# EAGLE design signal_mux_b (EAGLE 5.09)
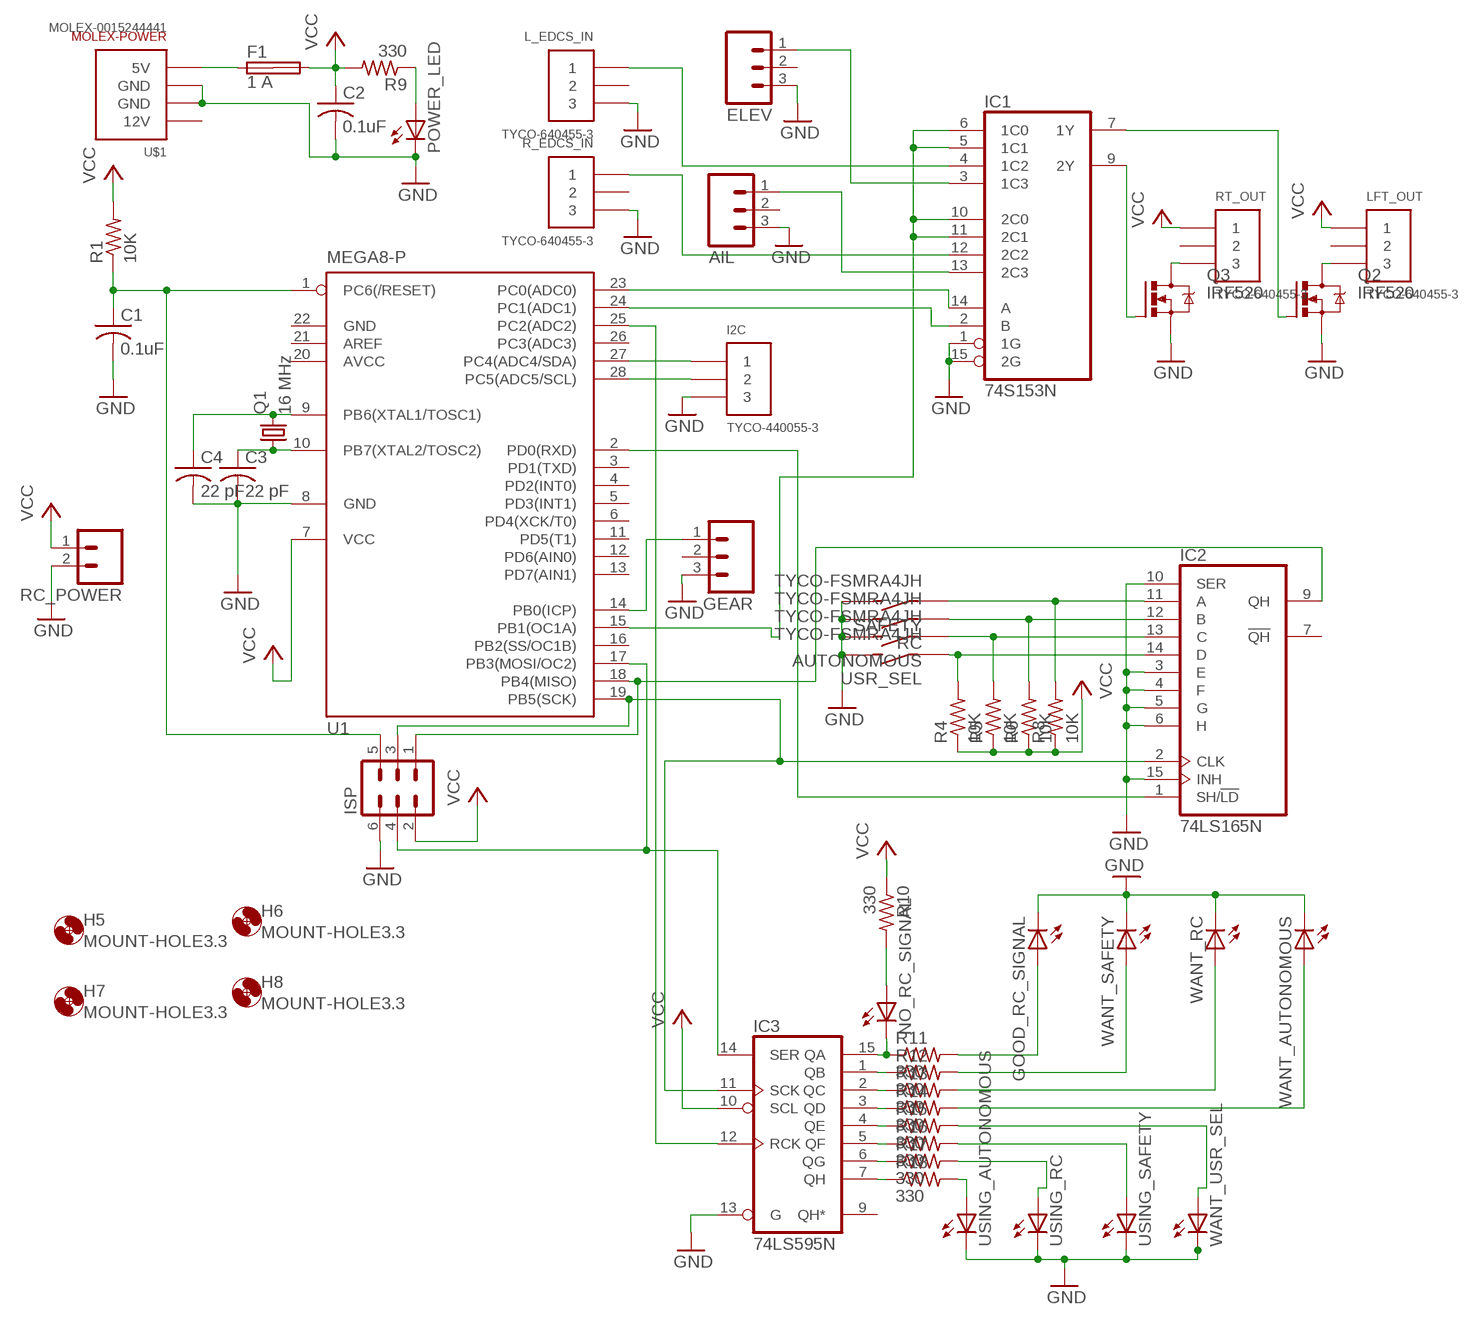
[diagram p0: schematic, sheet 1]

## Parts
AIL  M03POLAR  [MOLEX-1X3]
AUTONOMOUS  TYCO-FSMRA4JH  [TYCO-FSMRA4JH]
C1  0.1uF  C-US050-055X075  [C050-055X075]
C2  0.1uF  C-US050-055X075  [C050-055X075]
C3  22 pF  C-US025-025X050  [C025-025X050]
C4  22 pF  C-US025-025X050  [C025-025X050]
ELEV  M03POLAR  [MOLEX-1X3]
F1  1 A  SHK20Q  [SHK20Q]
GEAR  M03POLAR  [MOLEX-1X3]
GOOD_RC_SIGNAL  LED3MM  [LED3MM]
H5  MOUNT-HOLE3.3  [3,3]
H6  MOUNT-HOLE3.3  [3,3]
H7  MOUNT-HOLE3.3  [3,3]
H8  MOUNT-HOLE3.3  [3,3]
I2C  TYCO-440055-3  [HEADER-RA-2.00MM-3]
IC1  74S153N  [DIL16]
IC2  74LS165N  [DIL16]
IC3  74LS595N  [DIL16]
ISP  MA03-2  [MA03-2]
L_EDCS_IN  TYCO-640455-3  [HEADER-RA-POL-.100IN-3]
LFT_OUT  TYCO-640455-3  [HEADER-RA-POL-.100IN-3]
NO_RC_SIGNAL  LED3MM  [LED3MM]
POWER_LED  LED5MM  [LED5MM]
Q1  16 MHz  CRYSTALHC49S  [HC49/S]
Q2  IRF520  [TO220BV]
Q3  IRF520  [TO220BV]
R1  10K  R-US_0207/10  [0207/10]
R4  10K  R-US_0207/10  [0207/10]
R5  10K  R-US_0207/10  [0207/10]
R6  10K  R-US_0207/10  [0207/10]
R8  10K  R-US_0207/10  [0207/10]
R9  330  R-US_0207/10  [0207/10]
R10  330  R-US_0207/10  [0207/10]
R11  330  R-US_0207/10  [0207/10]
R12  330  R-US_0207/10  [0207/10]
R13  330  R-US_0207/10  [0207/10]
R14  330  R-US_0207/10  [0207/10]
R15  330  R-US_0207/10  [0207/10]
R16  330  R-US_0207/10  [0207/10]
R17  330  R-US_0207/10  [0207/10]
R18  330  R-US_0207/10  [0207/10]
R_EDCS_IN  TYCO-640455-3  [HEADER-RA-POL-.100IN-3]
RC  TYCO-FSMRA4JH  [TYCO-FSMRA4JH]
RC_POWER  M02POLAR  [MOLEX-1X2]
RT_OUT  TYCO-640455-3  [HEADER-RA-POL-.100IN-3]
SAFETY  TYCO-FSMRA4JH  [TYCO-FSMRA4JH]
U1  MEGA8-P  [DIL28-3]
U$1  MOLEX-0015244441  [MOLEX-0015244441B]
USING_AUTONOMOUS  LED3MM  [LED3MM]
USING_RC  LED3MM  [LED3MM]
USING_SAFETY  LED3MM  [LED3MM]
USR_SEL  TYCO-FSMRA4JH  [TYCO-FSMRA4JH]
WANT_AUTONOMOUS  LED3MM  [LED3MM]
WANT_RC  LED3MM  [LED3MM]
WANT_SAFETY  LED3MM  [LED3MM]
WANT_USR_SEL  LED3MM  [LED3MM]

## Nets
GND: AIL.3 AUTONOMOUS.2 C1.2 C2.2 C3.2 C4.2 ELEV.3 GEAR.3 GOOD_RC_SIGNAL.K(C) I2C.3 IC1.1(1G) IC1.15(2G) IC2.3(E) IC2.4(F) IC2.5(G) IC2.6(H) IC2.10(SER) IC2.15(INH) IC3.13(G) ISP.6 L_EDCS_IN.3 POWER_LED.K(C) Q2.S Q3.S R_EDCS_IN.3 RC.2 RC_POWER.2 SAFETY.2 U1.8(GND) U$1.2(GND) U$1.3(GND) USING_AUTONOMOUS.K(C) USING_RC.K(C) USING_SAFETY.K(C) USR_SEL.2 WANT_AUTONOMOUS.K(C) WANT_RC.K(C) WANT_SAFETY.K(C) WANT_USR_SEL.K(C)
N$1: C1.1 ISP.5 R1.1 U1.1(PC6(/RESET))
N$2: NO_RC_SIGNAL.A R10.2
N$3: IC3.15(QA) NO_RC_SIGNAL.K(C) R11.1
N$4: IC1.14(A) U1.23(PC0(ADC0))
N$5: GEAR.1 U1.14(PB0(ICP))
N$6: IC1.9(2Y) Q3.G
N$7: Q3.D RT_OUT.3
N$8: IC1.5(1C1) IC1.6(1C0) IC1.10(2C0) IC1.11(2C1) U1.15(PB1(OC1A))
N$9: IC2.1(SH/!LD) U1.2(PD0(RXD))
N$10: IC1.2(B) U1.24(PC1(ADC1))
N$11: IC1.4(1C2) L_EDCS_IN.1
N$12: IC1.12(2C2) R_EDCS_IN.1
N$13: AIL.1 IC1.13(2C3)
N$14: ELEV.1 IC1.3(1C3)
N$16: R18.2 USING_AUTONOMOUS.A
N$17: IC3.12(RCK) U1.25(PC2(ADC2))
N$18: LFT_OUT.3 Q2.D
N$20: R17.2 USING_RC.A
N$21: R16.2 USING_SAFETY.A
N$22: R15.2 WANT_USR_SEL.A
N$24: C3.1 Q1.1 U1.10(PB7(XTAL2/TOSC2))
N$25: IC2.14(D) R4.2 USR_SEL.1
N$26: AUTONOMOUS.1 IC2.13(C) R5.2
N$28: POWER_LED.A R9.1
N$30: IC2.11(A) R8.2 SAFETY.1
N$31: C4.1 Q1.2 U1.9(PB6(XTAL1/TOSC1))
N$32: IC2.12(B) R6.2 RC.1
N$35: IC1.7(1Y) Q2.G
N$36: IC3.1(QB) R12.1
N$37: IC3.2(QC) R13.1
N$38: IC3.3(QD) R14.1
N$39: IC3.4(QE) R15.1
N$40: IC3.5(QF) R16.1
N$41: IC3.6(QG) R17.1
N$42: IC3.7(QH) R18.1
N$44: F1.1A U$1.4(5V)
N$48: R14.2 WANT_AUTONOMOUS.A
N$49: R13.2 WANT_RC.A
N$50: R12.2 WANT_SAFETY.A
N$51: GOOD_RC_SIGNAL.A R11.2
N$55: I2C.1 U1.27(PC4(ADC4/SDA))
N$56: I2C.2 U1.28(PC5(ADC5/SCL))
N$65: IC2.9(QH) ISP.1 U1.18(PB4(MISO))
N$66: IC2.2(CLK) IC3.11(SCK) ISP.3 U1.19(PB5(SCK))
N$67: IC3.14(SER) ISP.4 U1.17(PB3(MOSI/OC2))
VCC: C2.1 F1.2A IC3.10(SCL) ISP.2 LFT_OUT.1 R1.2 R4.1 R5.1 R6.1 R8.1 R9.2 R10.1 RC_POWER.1 RT_OUT.1 U1.7(VCC)
Unconnected: AIL.2 ELEV.2 F1.1B F1.2B GEAR.2 IC2.7(!QH) IC3.9(QH*) L_EDCS_IN.2 LFT_OUT.2 R_EDCS_IN.2 RT_OUT.2 U1.3(PD1(TXD)) U1.4(PD2(INT0)) U1.5(PD3(INT1)) U1.6(PD4(XCK/T0)) U1.11(PD5(T1)) U1.12(PD6(AIN0)) U1.13(PD7(AIN1)) U1.16(PB2(SS/OC1B)) U1.21(AREF) U1.26(PC3(ADC3))

## Power pins joined to a net without a drawn wire
12V: U$1.1(12V)
AVCC: U1.20(AVCC)
GND: IC1.8(GND) IC2.8(GND) IC3.8(GND) U1.22(GND)
VCC: IC1.16(VCC) IC2.16(VCC) IC3.16(VCC)

## Library data of the parts
AIL ELEV GEAR = SparkFun:M03: Header 3 Standard 3-pin 0.1" header. Use with straight break away headers (SKU : PRT-00116), right angle break away headers (PRT-00553), swiss pins (PRT-00743), machine pins (PRT-00117), and female headers (PRT-00115). Molex polarized connector foot print use with SKU : PRT-08232 with associated crimp pins and housings.
AUTONOMOUS RC SAFETY USR_SEL = chicagoedt:TYCO-FSMRA4JH: Tyco Electronics FSMRA4JH tactile switch.
C1-C4 = resistor:C-US: CAPACITOR, American symbol
F1 = fuse:SHK20Q: FUSE HOLDER 5 x 20 mm, SH contact, E1207 Buerklin 64G6061
GOOD_RC_SIGNAL NO_RC_SIGNAL POWER_LED USING_AUTONOMOUS USING_RC USING_SAFETY WANT_AUTONOMOUS WANT_RC WANT_SAFETY WANT_USR_SEL = led:LED: LED OSRAM: - CHIPLED LG R971, LG N971, LY N971, LG Q971, LY Q971, LO R971, LY R971 LH N974, LH R974 LS Q976, LO Q976, LY Q976 LO Q996 - Hyper CHIPLED LW Q18S LB Q993, LB Q99A, LB R99A - SideLED LS A670, LO A670, LY A670, LG A670, LP A670 LB A673, LV A673, LT A673, LW A673 LH A674 LY A675 LS A676, LA A676, LO A676, LY A676, LW A676 LS A679, LY A679, LG A679 - Hyper Micro SIDELED® LS Y876, LA Y876, LO Y876, LY Y876 LT Y87S - SmartLED LW L88C, LW L88S LB L89C, LB L89S, LG L890 LS L89K, LO L89K, LY L89K LS L896, LA L896, LO L896, LY L896 - TOPLED LS T670, LO T670, LY T670, LG T670, LP T670 LSG T670, LSP T670, LSY T670, LOP T670, LYG T670 LG T671, LOG T671, LSG T671 LB T673, LV T673, LT T673, LW T673 LH T674 LS T676, LA T676, LO T676, LY T676, LB T676, LH T676, LSB T676, LW T676 LB T67C, LV T67C, LT T67C, LS T67K, LO T67K, LY T67K, LW E67C LS E67B, LA E67B, LO E67B, LY E67B, LB E67C, LV E67C, LT E67C LW T67C LS T679, LY T679, LG T679 LS T770, LO T770, LY T770, LG T770, LP T770 LB T773, LV T773, LT T773, LW T773 LH T774 LS E675, LA E675, LY E675, LS T675 LS T776, LA T776, LO T776, LY T776, LB T776 LHGB T686 LT T68C, LB T68C - Hyper Mini TOPLED® LB M676 - Mini TOPLED Santana® LG M470 LS M47K, LO M47K, LY M47K Source: http://www.osram.convergy.de LUXEON: - LUMILED® LXK2-PW12-R00, LXK2-PW12-S00, LXK2-PW14-U00, LXK2-PW14-V00 LXK2-PM12-R00, LXK2-PM12-S00, LXK2-PM14-U00 LXK2-PE12-Q00, LXK2-PE12-R00, LXK2-PE12-S00, LXK2-PE14-T00, LXK2-PE14-U00 LXK2-PB12-K00, LXK2-PB12-L00, LXK2-PB12-M00, LXK2-PB14-N00, LXK2-PB14-P00, LXK2-PB14-Q00 LXK2-PR12-L00, LXK2-PR12-M00, LXK2-PR14-Q00, LXK2-PR14-R00 LXK2-PD12-Q00, LXK2-PD12-R00, LXK2-PD12-S00 LXK2-PH12-R00, LXK2-PH12-S00 LXK2-PL12-P00, LXK2-PL12-Q00, LXK2-PL12-R00 Source: www.luxeon.com KINGBRIGHT: KA-3528ASYC Source: www.kingbright.com
H5-H8 = holes:MOUNT-HOLE: MOUNTING HOLE with drill center marker
I2C = chicagoedt:TYCO-440055-3: 3 pin right angle header with shroud and 2.00 mm pitch.
IC1 = 74xx-us:74*153: Dual 4-line to 1-line data SELECTOR/MULTIPLEXER
IC2 = 74xx-us:74*165: 8-bit parallel load SHIFT REGISTER
IC3 = 74xx-us:74*595: 8-bit SHIFT REGISTER, output latch
ISP = con-lstb:MA03-2: PIN HEADER
L_EDCS_IN LFT_OUT R_EDCS_IN RT_OUT = chicagoedt:TYCO-640455-3: 3 pin right angle header with polarizing tab and .100" pitch.
Q1 = crystal:CRYSTAL: CRYSTAL
Q2 Q3 = transistor-power:IRF520: HEXFET Power MOSFET
R1 R4-R6 R8-R18 = resistor:R-US_: RESISTOR, American symbol
RC_POWER = SparkFun:M02: Header 2 Standard 2-pin 0.1" header. Use with straight break away headers (SKU : PRT-00116), right angle break away headers (PRT-00553), swiss pins (PRT-00743), machine pins (PRT-00117), and female headers (PRT-00115). Molex polarized connector foot print use with SKU : PRT-08233 with associated crimp pins and housings.
U1 = atmel:MEGA8-P: MICROCONTROLLER 8 Kbytes FLASH, 1 kbytes SRAM, 512 bytes EEPROM, USART, 4-channel 10 bit ADC, 2-channel 8 bit ADC Pin compatible with Atmega48, ATMega88, ATMega168 Source: avr.lbr
U$1 = chicagoedt:MOLEX-0015244441: 5.08mm (.200") Pitch Disk Drive Power Connection System Header, Right Angle, Through Hole, 4 Circuits, Lead-free, 3.56mm (.140") PC Tail Length, with PCB Locator Peg

## Board
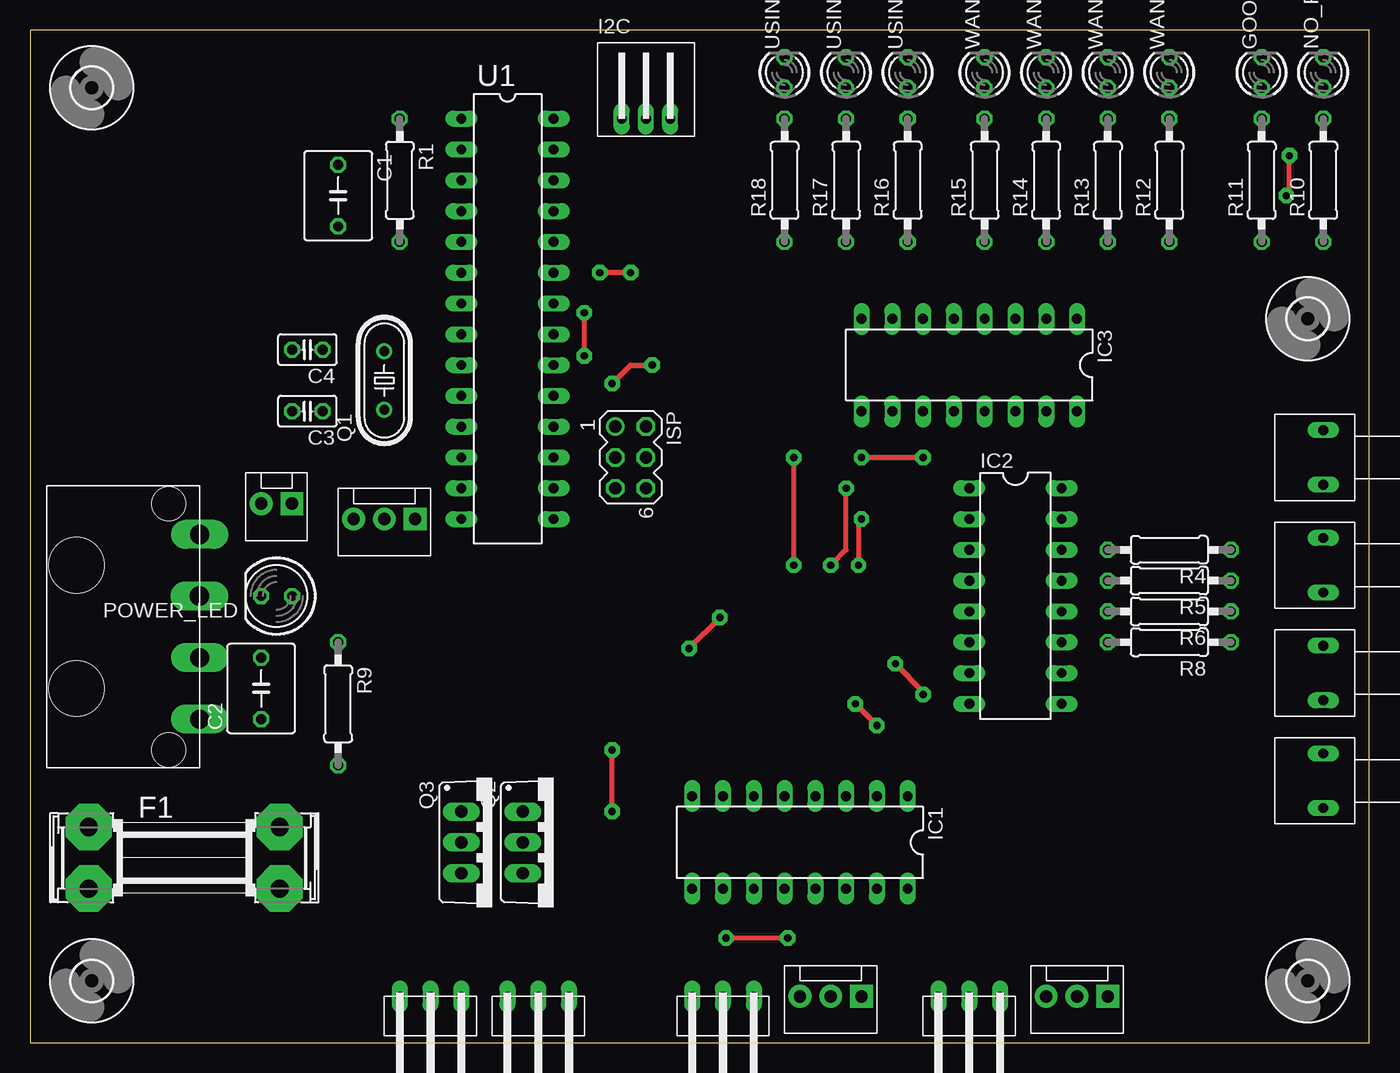
[diagram p1: board, top side]
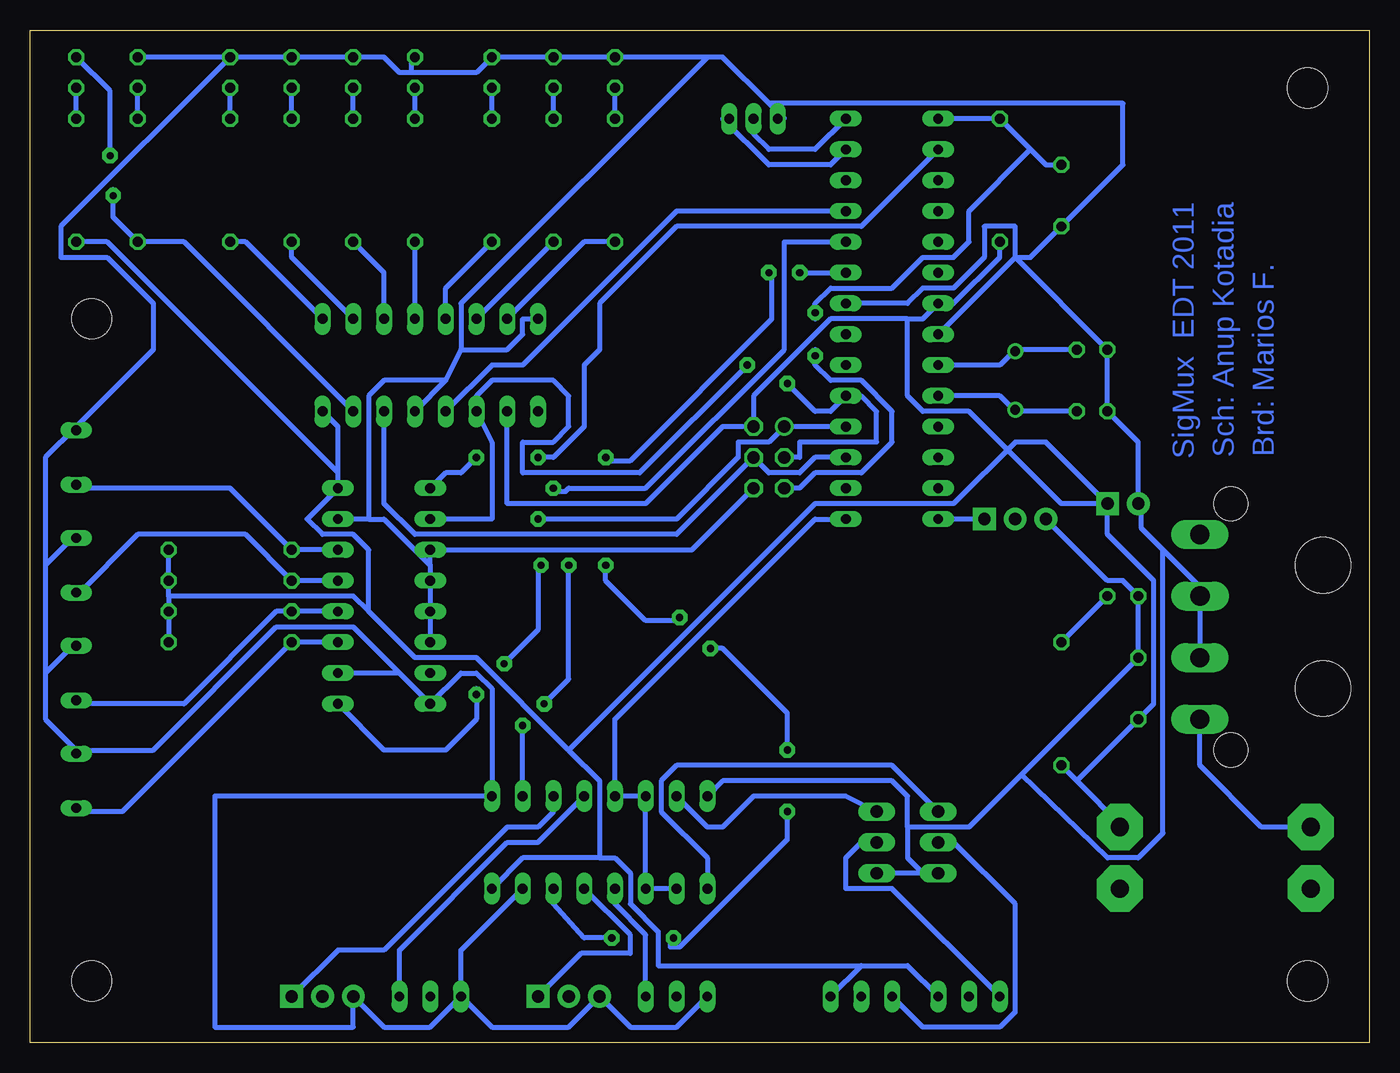
[diagram p2: board, bottom side, seen from below]

Size 110.47 x 83.49 mm. Coordinates in mm from the lower left corner, seen from the top.
Outline: 0,0 110.47,0 110.47,83.49 0,83.49 0,0
Copper layers (1*16): Top 0.035mm / dielectric 1.5mm / Bottom 0.035mm
Design rules "default *": minimum track width 16mil, minimum drill 24mil, track to track 16mil, track to pad 12mil, pad to pad 8mil, via to via 8mil, smd to smd 8mil, copper to edge 40mil, drill to drill 8mil, minimum pad ring 10mil, minimum via ring 8mil, stop-mask expansion 4mil, vias tented up to drill 0mil, thermal gap 10mil

### Footprints (pad centres in the part's own frame; a part is rotated, then mirrored left to right if it is on the bottom)
MOLEX-1X3 = drill 1.016 pad 1.88 square: 1 0,0 | drill 1.016 pad 1.88 round: 2 2.54,0; 3 5.08,0
TYCO-FSMRA4JH = drill 0.8 long: 1 -2.25,0; 2 2.25,0
C050-055X075 = drill 0.813 octagon: 1 -2.54,0; 2 2.54,0
C025-025X050 = drill 0.813 octagon: 1 -1.27,0; 2 1.27,0
SHK20Q = drill 1.5 pad 3.81 octagon: 1A -7.874,2.54; 1B -7.874,-2.54; 2A 7.874,2.54; 2B 7.874,-2.54
LED3MM = drill 0.813 octagon: A -1.27,0; K 1.27,0
3,3 = hole 3.3: 0,0
HEADER-RA-2.00MM-3 = drill 0.8 long: 1 2,0; 2 0,0; 3 -2,0
DIL16 = drill 0.813 long: 1 -8.89,-3.81; 2 -6.35,-3.81; 3 -3.81,-3.81; 4 -1.27,-3.81; 5 1.27,-3.81; 6 3.81,-3.81; 7 6.35,-3.81; 8 8.89,-3.81; 9 8.89,3.81; 10 6.35,3.81; 11 3.81,3.81; 12 1.27,3.81; 13 -1.27,3.81; 14 -3.81,3.81; 15 -6.35,3.81; 16 -8.89,3.81
MA03-2 = drill 1.016 round: 1 -2.54,-1.27 | drill 1.016 octagon: 2 -2.54,1.27; 3 0,-1.27; 4 0,1.27; 5 2.54,-1.27; 6 2.54,1.27
HEADER-RA-POL-.100IN-3 = drill 0.8 long: 1 -2.54,-5.08; 2 0,-5.08; 3 2.54,-5.08
LED5MM = drill 0.813 octagon: A -1.27,0; K 1.27,0
HC49/S = drill 0.813 round: 1 -2.413,0; 2 2.413,0
TO220BV = drill 1.016 long: D 0,-2.54; G -2.54,-2.54; S 2.54,-2.54
0207/10 = drill 0.813 octagon: 1 -5.08,0; 2 5.08,0
MOLEX-1X2 = drill 1.016 pad 1.88 square: 1 0,0 | drill 1.016 pad 1.88 round: 2 2.54,0
DIL28-3 = drill 0.813 long: 1 -16.51,-3.81; 2 -13.97,-3.81; 3 -11.43,-3.81; 4 -8.89,-3.81; 5 -6.35,-3.81; 6 -3.81,-3.81; 7 -1.27,-3.81; 8 1.27,-3.81; 9 3.81,-3.81; 10 6.35,-3.81; 11 8.89,-3.81; 12 11.43,-3.81; 13 13.97,-3.81; 14 16.51,-3.81; 15 16.51,3.81; 16 13.97,3.81; 17 11.43,3.81; 18 8.89,3.81; 19 6.35,3.81; 20 3.81,3.81; 21 1.27,3.81; 22 -1.27,3.81; 23 -3.81,3.81; 24 -6.35,3.81; 25 -8.89,3.81; 26 -11.43,3.81; 27 -13.97,3.81; 28 -16.51,3.81
MOLEX-0015244441B = drill 1.587 pad 1.778 long: 1 7.62,-6.35; 3 -2.54,-6.35; 4 -7.62,-6.35 | drill 1.6 pad 1.651 long: 2 2.54,-6.35 | hole 2.794: -10.16,-3.81; 10.16,-3.81 | hole 4.572: -5.08,3.81; 5.08,3.81

### Placement (x,y rotation side)
AIL  68.58,3.81 180 top
AUTONOMOUS  106.68,39.37 90 top
C1  25.4,69.85 270 top
C2  19.05,29.21 90 top
C3  22.86,52.07 180 top
C4  22.86,57.15 180 top
ELEV  88.9,3.81 180 top
F1  12.7,15.24 0 top
GEAR  31.75,43.18 180 top
GOOD_RC_SIGNAL  101.6,80.01 90 top
H5  5.08,5.08 0 top
H6  5.08,78.74 0 top
H7  105.41,5.08 0 top
H8  105.41,59.69 0 top
I2C  50.8,76.2 0 top
IC1  63.5,16.51 180 top
IC2  81.28,36.83 270 top
IC3  77.47,55.88 180 top
ISP  49.53,48.26 270 top
L_EDCS_IN  77.47,-1.27 180 top
LFT_OUT  33.02,-1.27 180 top
NO_RC_SIGNAL  106.68,80.01 90 top
POWER_LED  20.32,36.83 180 top
Q1  29.21,54.61 90 top
Q2  43.18,16.51 270 top
Q3  38.1,16.51 270 top
R1  30.48,71.12 270 top
R4  93.98,40.64 180 top
R5  93.98,38.1 180 top
R6  93.98,35.56 180 top
R8  93.98,33.02 180 top
R9  25.4,27.94 270 top
R10  106.68,71.12 90 top
R11  101.6,71.12 90 top
R12  93.98,71.12 90 top
R13  88.9,71.12 90 top
R14  83.82,71.12 90 top
R15  78.74,71.12 90 top
R16  72.39,71.12 90 top
R17  67.31,71.12 90 top
R18  62.23,71.12 90 top
R_EDCS_IN  57.15,-1.27 180 top
RC  106.68,30.48 90 top
RC_POWER  21.59,44.45 180 top
RT_OUT  41.91,-1.27 180 top
SAFETY  106.68,21.59 90 top
U1  39.37,59.69 270 top
U$1  7.62,34.29 90 top
USING_AUTONOMOUS  62.23,80.01 90 top
USING_RC  67.31,80.01 90 top
USING_SAFETY  72.39,80.01 90 top
USR_SEL  106.68,48.26 90 top
WANT_AUTONOMOUS  83.82,80.01 90 top
WANT_RC  88.9,80.01 90 top
WANT_SAFETY  93.98,80.01 90 top
WANT_USR_SEL  78.74,80.01 90 top

### Tracks (layer width: path | path; a pad name or v marks a point on that pad's centre or on a via)
GND
  Bottom 0.406: R_EDCS_IN.3 57.15,1.27 60.96,1.27 AIL.3 66.04,1.27 72.39,1.27 L_EDCS_IN.3 | L_EDCS_IN.3 74.93,7.62 IC1.15 | 106.68,24.13 109.22,26.67 109.22,30.48 | 109.22,30.48 106.68,33.02 RC.2 | 109.22,39.37 106.68,41.91 AUTONOMOUS.2 | 109.22,39.37 109.22,30.48 | 106.68,50.8 109.22,48.26 109.22,39.37 | 80.01,30.48 IC2.10 | 80.01,30.48 IC2.8 74.93,30.48 73.66,30.48 72.39,29.21 IC1.1 95.25,20.32 95.25,1.27 83.82,1.27 ELEV.3 81.28,1.27 77.47,1.27 L_EDCS_IN.3 | 106.68,24.13 100.33,24.13 90.17,34.29 83.82,34.29 80.01,30.48 | 106.68,24.13 SAFETY.2 | GEAR.3 21.59,38.1 20.32,38.1 POWER_LED.K C2.2 28.7,22.1 | IC1.8 53.34,21.59 39.37,21.59 38.1,20.32 38.1,17.78 | 38.1,17.78 38.1,15.24 36.83,13.97 | 36.83,13.97 Q2.S | 36.83,13.97 Q3.S | 28.7,22.1 33.02,17.78 38.1,17.78 | 29.21,64.77 27.94,64.77 C1.2 20.32,72.39 20.32,77.47 49.53,77.47 | 29.21,64.77 U1.8 | U$1.3 U$1.2 13.97,37.59 17.02,40.64 | 17.02,40.64 18.8,42.42 18.8,44.45 RC_POWER.2 19.05,49.53 C3.2 C4.2 29.21,64.77 | IC2.6 IC2.5 IC2.4 77.47,39.37 | 77.47,39.37 IC2.3 55.88,40.64 ISP.6 | 82.55,43.18 81.28,43.18 77.47,39.37 | 82.55,43.18 IC2.15 | WANT_SAFETY.K WANT_RC.K WANT_AUTONOMOUS.K 81.28,81.28 80.01,80.01 78.99,80.01 | WANT_SAFETY.K GOOD_RC_SIGNAL.K | IC3.8 69.85,59.69 69.85,58.42 71.12,57.15 74.93,57.15 | 76.2,54.61 IC3.13 | 74.93,57.15 76.2,54.61 | 49.53,77.47 53.34,81.28 54.61,81.28 | 49.53,77.47 48.26,76.2 I2C.3 | 54.61,81.28 USING_AUTONOMOUS.K USING_RC.K USING_SAFETY.K 73.66,80.01 78.99,80.01 | 74.93,57.15 74.93,60.96 54.61,81.28 | 82.55,43.18 82.55,53.34 81.28,54.61 76.2,54.61 | 28.7,22.1 21.59,15.24 19.05,15.24 17.02,17.27 17.02,40.64 | 106.68,50.8 100.33,57.15 100.33,60.96 104.14,64.77 107.95,64.77 107.95,67.31 WANT_SAFETY.K
  Bottom 0.406: 106.68,50.8 USR_SEL.2 | U1.22 38.1,60.96 36.83,62.23 34.29,62.23 31.75,64.77 31.75,67.31 29.21,67.31 29.21,64.77 | WANT_USR_SEL.K 78.99,81.28 78.99,80.01
N$1  (via drill 0.6 pad 1.27)
  Top 0.406: v45.72,56.64 v45.72,60.2
  Bottom 0.406: 27.94,73.66 26.67,72.39 C1.1 | 27.94,73.66 R1.1 U1.1 | 45.72,57.15 v45.72,56.64 45.72,55.88 44.45,54.61 41.91,54.61 39.37,52.07 39.37,49.53 41.91,46.99 45.72,46.99 46.99,45.72 ISP.5 | 45.72,59.69 v45.72,60.2 45.72,60.96 44.45,62.23 39.37,62.23 36.83,64.77 34.29,64.77 33.02,66.04 33.02,68.58 27.94,73.66
N$2
  Bottom 0.406: R10.2 NO_RC_SIGNAL.A
N$3  (via drill 0.6 pad 1.27)
  Top 0.406: v103.89,73.15 103.89,70.1 v103.63,69.85
  Bottom 0.406: IC3.15 97.79,66.04 R11.1 103.63,68.07 v103.63,69.85 103.63,70.36 | 103.89,72.9 v103.89,73.15 103.89,78.49 NO_RC_SIGNAL.K
N$4  (via drill 0.6 pad 1.27)
  Top 0.406: v49.53,63.5 v46.99,63.5 | v62.99,39.37 v62.99,48.26 | v54.36,32.51 v56.9,35.05 | v48.01,19.05 v48.01,24.13 | v57.4,8.64 v62.48,8.64
  Bottom 0.406: v46.99,63.5 U1.23 | 62.23,8.64 v62.48,8.64 64.77,8.64 67.31,11.43 IC1.14 | v49.53,63.5 49.28,63.25 49.28,59.69 60.96,48.01 62.74,48.01 v62.99,48.26 | v62.99,39.37 62.99,38.1 59.69,34.8 56.9,34.8 v56.9,35.05 | v54.36,32.51 53.34,32.51 48.01,27.18 v48.01,24.13 48.01,23.88 | v48.01,19.05 48.01,16.76 56.9,7.87 57.66,7.87 57.66,8.38 v57.4,8.64
N$5
  Bottom 0.406: GEAR.1 U1.14
N$6
  Bottom 0.406: IC1.9 54.61,15.24 58.42,19.05 58.42,21.59 57.15,22.86 39.37,22.86 Q3.G
N$7
  Bottom 0.406: RT_OUT.3 36.83,1.27 30.48,1.27 29.21,2.54 29.21,11.43 34.29,16.51 Q3.D
N$8
  Bottom 0.406: IC1.10 IC1.11 IC1.6 IC1.5 62.23,26.67 45.72,43.18 U1.15
N$9  (via drill 0.6 pad 1.27)
  Top 0.406: v68.58,48.26 v73.66,48.26
  Bottom 0.406: U1.2 41.91,67.31 57.15,67.31 63.5,60.96 63.5,57.15 64.77,55.88 64.77,50.8 67.31,48.26 v68.58,48.26 | IC2.1 76.2,46.99 74.93,46.99 v73.66,48.26
N$10  (via drill 0.6 pad 1.27)
  Top 0.406: v69.85,26.16 v68.07,27.94 | v67.31,45.72 67.31,40.64 v66.04,39.37
  Bottom 0.406: U1.24 48.26,66.04 48.26,57.15 59.69,45.72 66.04,45.72 66.29,45.47 67.06,45.47 v67.31,45.72 | IC1.2 v69.85,26.16 | v66.04,39.37 66.04,29.97 v68.07,27.94
N$11
  Bottom 0.406: L_EDCS_IN.1 80.01,7.62 71.12,16.51 68.58,16.51 IC1.4
N$12
  Bottom 0.406: R_EDCS_IN.1 59.69,8.89 62.23,11.43 IC1.12
N$13
  Bottom 0.406: IC1.13 60.96,8.89 60.96,7.37 65.02,7.37 AIL.1
N$14
  Bottom 0.406: ELEV.1 85.09,7.62 81.28,7.62 71.12,17.78 68.58,17.78 67.31,19.05 IC1.3
N$16
  Bottom 0.406: R18.2 USING_AUTONOMOUS.A
N$17
  Bottom 0.406: U1.25 57.15,68.58 69.85,55.88 72.39,55.88 IC3.12
N$18
  Bottom 0.406: LFT_OUT.3 39.37,12.7 43.18,12.7 43.18,15.24 41.91,16.51 Q2.D
N$20
  Bottom 0.406: R17.2 USING_RC.A
N$21
  Bottom 0.406: R16.2 USING_SAFETY.A
N$22
  Bottom 0.406: R15.2 WANT_USR_SEL.A
N$24
  Bottom 0.406: C3.1 29.21,52.07 | U1.10 30.48,53.34 29.21,52.07 | 29.21,52.07 Q1.1
N$25
  Bottom 0.406: USR_SEL.1 106.68,45.72 93.98,45.72 R4.2 IC2.14
N$26
  Bottom 0.406: AUTONOMOUS.1 106.68,36.83 101.6,41.91 92.71,41.91 R5.2 IC2.13
N$28
  Bottom 0.406: POWER_LED.A R9.1
N$30
  Bottom 0.406: SAFETY.1 106.68,19.05 102.87,19.05 R8.2 IC2.11
N$31
  Bottom 0.406: C4.1 29.21,57.15 | U1.9 30.48,55.88 29.21,57.15 | 29.21,57.15 Q1.2
N$32
  Bottom 0.406: RC.1 106.68,27.94 97.79,27.94 90.17,35.56 R6.2 IC2.12
N$35
  Bottom 0.406: IC1.7 54.61,17.78 53.34,17.78 50.8,20.32 43.18,20.32 Q2.G
N$36
  Bottom 0.406: IC3.1 92.71,66.04 R12.1
N$37
  Bottom 0.406: IC3.2 88.9,64.77 R13.1
N$38
  Bottom 0.406: IC3.3 81.28,63.5 R14.1
N$39
  Bottom 0.406: IC3.4 R15.1
N$40
  Bottom 0.406: IC3.5 76.2,62.23 R16.1
N$41
  Bottom 0.406: R17.1 IC3.6
N$42
  Bottom 0.406: IC3.7 64.77,66.04 R18.1
N$44
  Bottom 0.406: U$1.4 13.97,22.86 8.89,17.78 F1.1A
N$48
  Bottom 0.406: R14.2 WANT_AUTONOMOUS.A
N$49
  Bottom 0.406: R13.2 WANT_RC.A
N$50
  Bottom 0.406: R12.2 WANT_SAFETY.A
N$51
  Bottom 0.406: R11.2 GOOD_RC_SIGNAL.A
N$55
  Bottom 0.406: U1.27 44.45,72.39 49.53,72.39 53.34,76.2 I2C.1
N$56
  Bottom 0.406: I2C.2 50.8,74.93 49.53,73.66 45.72,73.66 U1.28
N$65  (via drill 0.6 pad 1.27)
  Top 0.406: v71.37,31.24 73.66,28.96 v73.66,28.7 | v68.58,43.18 68.33,42.93 v68.33,39.37
  Bottom 0.406: U1.18 ISP.1 49.53,49.53 52.07,49.53 52.07,48.26 57.15,43.18 v68.58,43.18 | IC2.9 81.28,24.13 76.2,24.13 73.66,26.67 v73.66,28.7 73.66,29.21 | 71.63,31.24 v71.37,31.24 68.58,34.04 68.58,39.37 | 68.58,39.37 68.58,39.62 | v68.33,39.37 68.58,39.37
N$66  (via drill 0.6 pad 1.27)
  Top 0.406: v51.31,55.88 49.53,55.88 v48.01,54.36
  Bottom 0.406: ISP.3 46.99,48.26 46.99,49.53 40.64,49.53 40.64,52.07 41.91,53.34 U1.19 44.45,52.07 45.72,52.07 v48.01,54.36 48.26,54.61 | IC2.2 72.39,43.18 72.39,49.53 IC3.11 73.66,53.34 72.39,54.61 67.31,54.61 66.04,53.34 66.04,50.8 67.31,49.53 69.85,49.53 69.85,46.99 60.2,46.99 v51.31,55.88
N$67
  Bottom 0.406: U1.17 45.72,48.26 46.99,46.99 49.53,46.99 ISP.4 57.15,41.91 78.74,41.91 81.28,44.45 IC3.14
VCC
  Bottom 0.406: 24.13,21.59 20.32,17.78 F1.2A | 24.13,21.59 R9.2 | 24.13,21.59 C2.1 17.78,27.94 17.78,38.1 21.59,41.91 RC_POWER.1 | IC3.10 71.12,44.45 59.69,44.45 53.34,50.8 ISP.2 50.8,53.34 44.45,59.69 38.1,59.69 | 38.1,59.69 36.83,59.69 U1.7 34.29,60.96 30.48,64.77 R1.2 | RC_POWER.1 25.4,44.45 33.02,52.07 36.83,52.07 38.1,53.34 38.1,59.69 | 85.09,46.99 85.09,50.8 IC3.16 | 85.09,46.99 IC2.16 87.63,43.18 86.36,41.91 83.82,41.91 82.55,40.64 82.55,35.56 | R10.1 104.14,66.04 85.09,46.99 | R8.1 R6.1 99.06,36.83 | R4.1 R5.1 99.06,36.83 | LFT_OUT.1 38.1,6.35 41.91,6.35 | 41.91,6.35 RT_OUT.1 | IC1.16 69.85,15.24 63.5,15.24 | 63.5,15.24 62.23,15.24 60.96,13.97 60.96,11.43 58.67,9.14 58.67,6.35 41.91,6.35 | 99.06,36.83 83.82,36.83 82.55,35.56 | 82.55,35.56 78.74,31.75 73.66,31.75 66.04,24.13 | 66.04,24.13 63.5,21.59 63.5,15.24 | RC_POWER.1 26.67,49.53 29.21,49.53 34.29,44.45 45.72,44.45 66.04,24.13

### Text on the board
Bottom: Sch: Anup Kotadia | SigMux EDT 2011 | Brd: Marios F.